# EAGLE schematic carcomputer_split3 (EAGLE 9.3.2)
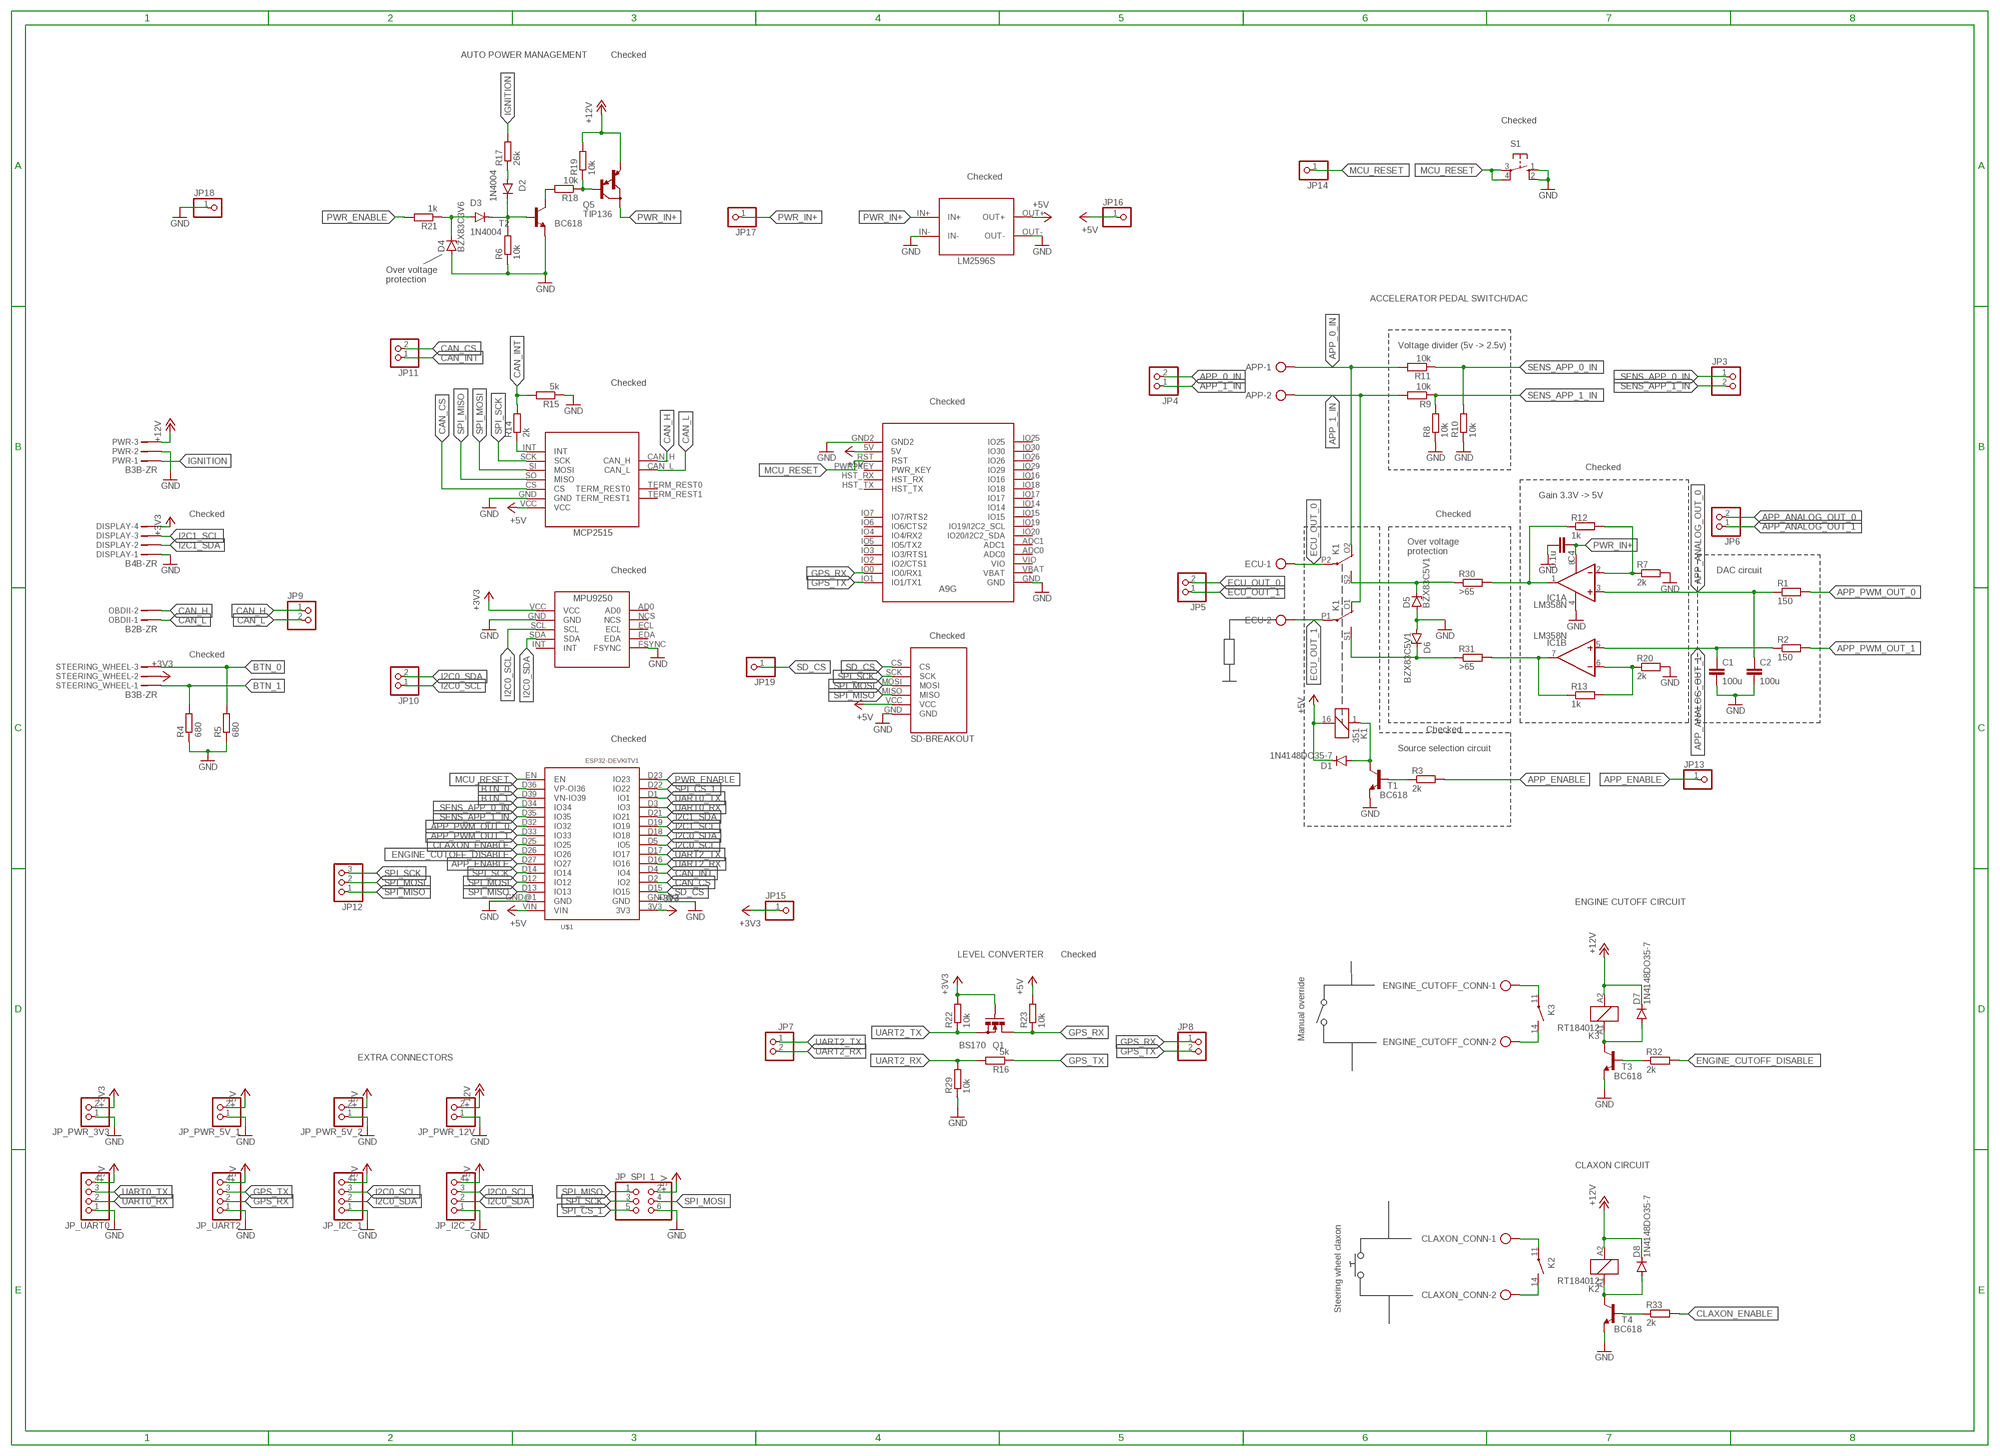
[diagram p0: schematic, sheet 1]

## Parts
APP  AK300/2  [AK300/2]
C1  100u  C-EU025-050X050  [C025-050X050]
C2  100u  C-EU025-050X050  [C025-050X050]
C4  0.1u  C-EU025-050X050  [C025-050X050]
CLAXON_CONN  AK300/2  [AK300/2]
D1  1N4148DO35-7  [DO35-7]
D2  1N4004  [DO41-10]
D3  1N4004  [DO41-10]
D4  BZX83C3V6  BZX85  [DO41Z10]
D5  BZX83C5V1  BZX85  [DO41Z10]
D6  BZX83C5V1  BZX85  [DO41Z10]
D7  1N4148DO35-7  [DO35-7]
D8  1N4148DO35-7  [DO35-7]
DISPLAY  B4B-ZR  [B4B-ZR]
ECU  AK300/2  [AK300/2]
ENGINE_CUTOFF_CONN  AK300/2  [AK300/2]
IC1  LM358N  [DIL08]
JP3  PINHD-1X2  [1X02]
JP4  PINHD-1X2  [1X02]
JP5  PINHD-1X2  [1X02]
JP6  PINHD-1X2  [1X02]
JP7  PINHD-1X2  [1X02]
JP8  PINHD-1X2  [1X02]
JP9  PINHD-1X2  [1X02]
JP10  PINHD-1X2  [1X02]
JP11  PINHD-1X2  [1X02]
JP12  PINHD-1X3  [1X03]
JP13  PINHD-1X1  [1X01]
JP14  PINHD-1X1  [1X01]
JP15  PINHD-1X1  [1X01]
JP16  PINHD-1X1  [1X01]
JP17  PINHD-1X1  [1X01]
JP18  PINHD-1X1  [1X01]
JP19  PINHD-1X1  [1X01]
JP_I2C_1  PINHD-1X4  [1X04]
JP_I2C_2  PINHD-1X4  [1X04]
JP_PWR_3V3  PINHD-1X2  [1X02]
JP_PWR_5V_1  PINHD-1X2  [1X02]
JP_PWR_5V_2  PINHD-1X2  [1X02]
JP_PWR_12V  PINHD-1X2  [1X02]
JP_SPI_1  PINHD-2X3  [2X03]
JP_UART0  PINHD-1X4  [1X04]
JP_UART2  PINHD-1X4  [1X04]
K1  351  [351]
K2  RT184012  [RT-N/O12A3.5]
K3  RT184012  [RT-N/O12A3.5]
OBDII  B2B-ZR  [B2B-ZR]
PWR  B3B-ZR  [B3B-ZR]
Q1  BS170  [SOT54E]
Q5  TIP136  [TO220]
R1  150  R-EU_0207/7  [0207/7]
R2  150  R-EU_0207/7  [0207/7]
R3  2k  R-EU_0207/7  [0207/7]
R4  680  R-EU_0207/7  [0207/7]
R5  680  R-EU_0207/7  [0207/7]
R6  10k  R-EU_0207/7  [0207/7]
R7  2k  R-EU_0207/7  [0207/7]
R8  10k  R-EU_0207/7  [0207/7]
R9  10k  R-EU_0207/7  [0207/7]
R10  10k  R-EU_0207/7  [0207/7]
R11  10k  R-EU_0207/7  [0207/7]
R12  1k  R-EU_0207/7  [0207/7]
R13  1k  R-EU_0207/7  [0207/7]
R14  2k  R-EU_0207/7  [0207/7]
R15  5k  R-EU_0207/7  [0207/7]
R16  5k  R-EU_0207/7  [0207/7]
R17  26k  R-EU_0207/7  [0207/7]
R18  10k  R-EU_0207/7  [0207/7]
R19  10k  R-EU_0207/7  [0207/7]
R20  2k  R-EU_0207/7  [0207/7]
R21  1k  R-EU_0207/7  [0207/7]
R22  10k  R-EU_0207/7  [0207/7]
R23  10k  R-EU_0207/7  [0207/7]
R29  10k  R-EU_0207/7  [0207/7]
R30  >65  R-EU_0207/7  [0207/7]
R31  >65  R-EU_0207/7  [0207/7]
R32  2k  R-EU_0207/7  [0207/7]
R33  2k  R-EU_0207/7  [0207/7]
S1  10-XX  [B3F-10XX]
STEERING_WHEEL  B3B-ZR  [B3B-ZR]
T1  BC618  [TO92-EBC]
T2  BC618  [TO92-EBC]
T3  BC618  [TO92-EBC]
T4  BC618  [TO92-EBC]
U$1  ESP32DEVKITV1  [ESP32-DEVKITV1]
U$2  MCP2515_DEVBOARDINVERTED  [MCP2515_DEVBOARD_INVERTED]
U$3  MPU9250_BREAKOUT  [MPU9250_BREAKOUT]
U$4  LM2596S  [LM2596S]
U$5  HKD-MICRO-SD-BREAKOUT  [HKD-MICRO-SD-BREAKOUT]
U$6  A9G  [A9G]

## Nets
+3V3: DISPLAY.4 JP15.1 JP_PWR_3V3.2 Q1.G R22.2 STEERING_WHEEL.2 U$1.3V3 U$3.VCC
+5V: D1.C JP16.1 JP_I2C_1.4 JP_I2C_2.4 JP_PWR_5V_1.2 JP_PWR_5V_2.2 JP_SPI_1.2 JP_UART0.4 JP_UART2.4 K1.16 R23.2 U$1.VIN U$2.VCC U$4.OUT+ U$5.VCC U$6.5V
+12V: D7.C D8.C JP_PWR_12V.2 K2.A2 K3.A2 PWR.3 Q5.3(E) R19.2
APP_0_IN: APP.1 JP4.2 K1.O2(3:O) R11.2
APP_1_IN: APP.2 JP4.1 K1.O1(2:O) R9.2
APP_ANALOG_OUT_0: C2.1 IC1.3(A:+IN) JP6.2 R1.1
APP_ANALOG_OUT_1: C1.1 IC1.5(B:+IN) JP6.1 R2.1
APP_ENABLE: JP13.1 R3.2 U$1.D27(IO27)
APP_PWM_OUT_0: R1.2 U$1.D32(IO32)
APP_PWM_OUT_1: R2.2 U$1.D33(IO33)
BTN_0: R5.2 STEERING_WHEEL.3 U$1.D36(VP-OI36)
BTN_1: R4.2 STEERING_WHEEL.1 U$1.D39(VN-IO39)
CAN_CS: JP11.2 U$1.D2(IO2) U$2.CS
CAN_H: JP9.1 OBDII.2 U$2.CAN_H
CAN_INT: JP11.1 R14.2 R15.2 U$1.D4(IO4)
CAN_L: JP9.2 OBDII.1 U$2.CAN_L
CLAXON_ENABLE: R33.2 U$1.D25(IO25)
ECU_OUT_0: ECU.1 JP5.2 K1.P2(3:P)
ECU_OUT_1: ECU.2 JP5.1 K1.P1(2:P)
ENGINE_CUTOFF_DISABLE: R32.2 U$1.D26(IO26)
GND: C1.2 C2.2 C4.2 D4.A D5.A D6.A DISPLAY.1 IC1.4(P:V-) JP18.1 JP_I2C_1.1 JP_I2C_2.1 JP_PWR_3V3.1 JP_PWR_5V_1.1 JP_PWR_5V_2.1 JP_PWR_12V.1 JP_SPI_1.6 JP_UART0.1 JP_UART2.1 PWR.2 R4.1 R5.1 R6.1 R7.2 R8.1 R10.1 R15.1 R20.2 R29.1 S1.1(S) S1.2(S1) T1.E T2.E T3.E T4.E U$1.GND@1(GND) U$1.GND@2(GND) U$2.GND U$3.FSYNC U$3.GND U$4.IN- U$4.OUT- U$5.GND U$6.GND U$6.GND2
GPS_RX: JP8.1 JP_UART2.2 Q1.D R23.1 U$6.IO0(IO0/RX1)
GPS_TX: JP8.2 JP_UART2.3 R16.1 U$6.IO1(IO1/TX1)
I2C0_SCL: JP10.1 JP_I2C_1.3 JP_I2C_2.3 U$1.D5(IO5) U$3.SCL
I2C0_SDA: JP10.2 JP_I2C_1.2 JP_I2C_2.2 U$1.D18(IO18) U$3.SDA
I2C1_SCL: DISPLAY.3 U$1.D19(IO19)
I2C1_SDA: DISPLAY.2 U$1.D21(IO21)
IGNITION: PWR.1 R17.2
MCU_RESET: JP14.1 S1.3(P) S1.4(P1) U$1.EN U$6.RST
N$1: D1.A K1.1 T1.C
N$2: R3.1 T1.B
N$3: D6.C K1.S1(2:S) R31.1
N$4: IC1.1(A:OUT) R12.1 R30.2
N$5: D2.C D3.C R6.2 T2.B
N$10: R14.1 U$2.INT
N$11: D3.A D4.C R21.1
N$12: D2.A R17.1
N$13: IC1.2(A:-IN) R7.1 R12.2
N$14: Q5.1(B) R18.1 R19.1
N$15: R18.2 T2.C
N$16: IC1.6(B:-IN) R13.2 R20.1
N$17: D5.C K1.S2(3:S) R30.1
N$18: IC1.7(B:OUT) R13.1 R31.2
N$19: ENGINE_CUTOFF_CONN.1 K3.11(2:P)
N$20: ENGINE_CUTOFF_CONN.2 K3.14(2:S)
N$22: D7.A K3.A1 T3.C
N$23: D8.A K2.A1 T4.C
N$25: R33.1 T4.B
N$26: R32.1 T3.B
N$27: CLAXON_CONN.1 K2.11(2:P)
N$28: CLAXON_CONN.2 K2.14(2:S)
PWR_ENABLE: R21.2 U$1.D23(IO23)
PWR_IN+: C4.1 IC1.8(P:V+) JP17.1 Q5.2(C) U$4.IN+
SD_CS: JP19.1 U$1.D15(IO15) U$5.CS
SENS_APP_0_IN: JP3.1 R10.2 R11.1 U$1.D34(IO34)
SENS_APP_1_IN: JP3.2 R8.2 R9.1 U$1.D35(IO35)
SPI_CS_1: JP_SPI_1.5 U$1.D22(IO22)
SPI_MISO: JP12.1 JP_SPI_1.1 U$1.D13(IO13) U$2.SO(MISO) U$5.MISO
SPI_MOSI: JP12.2 JP_SPI_1.4 U$1.D12(IO12) U$2.SI(MOSI) U$5.MOSI
SPI_SCK: JP12.3 JP_SPI_1.3 U$1.D14(IO14) U$2.SCK U$5.SCK
UART0_RX: JP_UART0.2 U$1.D3(IO3)
UART0_TX: JP_UART0.3 U$1.D1(IO1)
UART2_RX: JP7.2 R16.2 R29.2 U$1.D16(IO16)
UART2_TX: JP7.1 Q1.S R22.1 U$1.D17(IO17)
Unconnected: U$2.TERM_REST0 U$2.TERM_REST1 U$3.AD0 U$3.ECL U$3.EDA U$3.INT U$3.NCS U$6.ADC0 U$6.ADC1 U$6.HST_RX U$6.HST_TX U$6.IO2(IO2/CTS1) U$6.IO3(IO3/RTS1) U$6.IO4(IO4/RX2) U$6.IO5(IO5/TX2) U$6.IO6(IO6/CTS2) U$6.IO7(IO7/RTS2) U$6.IO14 U$6.IO15 U$6.IO16 U$6.IO17 U$6.IO18 U$6.IO19(IO19/I2C2_SCL) U$6.IO20(IO20/I2C2_SDA) U$6.IO25 U$6.IO26 U$6.IO29 U$6.IO30 U$6.PWR_KEY U$6.VBAT U$6.VIO

## Notes on the sheet
- AUTO POWER MANAGEMENT | Checked
- Checked
- Checked
- Over voltage
  protection
- ACCELERATOR PEDAL SWITCH/DAC
- Voltage divider (5v -> 2.5v)
- Checked
- Checked
- Checked
- Gain 3.3V -> 5V
- Checked | Checked
- Over voltage
  protection
- Checked | DAC circuit
- Checked
- Checked
- Checked
- Checked
- Source selection circuit
- ENGINE CUTOFF CIRCUIT
- LEVEL CONVERTER | Checked
- Manual override
- EXTRA CONNECTORS
- CLAXON CIRCUIT
- Steering wheel claxon

## Library data of the parts
APP CLAXON_CONN ECU ENGINE_CUTOFF_CONN = con-ptr500-custom:AK300/2: CONNECTOR; OC_FARNELL: unknown; OC_NEWARK: unknown
C1 C2 C4 = rcl:C-EU: CAPACITOR, European symbol; SPICEPREFIX: C
D1 D7 D8 = diode:1N4148: DIODE high speed (Philips)
D2 D3 = diode:1N4004: DIODE general purpose rectifier, 1 A
D4-D6 = diode:BZX85: Z DIODE
DISPLAY = con-jst-custom:?4B-ZR: ZH CONNECTOR 1.5 mm, 4 pin 1 row Source: http://www.jst.com .. eZH.pdf; MF: FARNELL; MPN: B4B-ZR(LF)(SN); OC_FARNELL: 1830916; OC_NEWARK: 37K9960
IC1 = linear:LM358: OP AMP also LM158; LM258; LM2904 Source: http://cache.national.com/ds/LM/LM158.pdf
JP3-JP11 JP_PWR_3V3 JP_PWR_5V_1 JP_PWR_5V_2 JP_PWR_12V = pinhead:PINHD-1X2: PIN HEADER
JP12 = pinhead:PINHD-1X3: PIN HEADER
JP13-JP19 = pinhead:PINHD-1X1: PIN HEADER
JP_I2C_1 JP_I2C_2 JP_UART0 JP_UART2 = pinhead:PINHD-1X4: PIN HEADER
JP_SPI_1 = pinhead:PINHD-2X3: PIN HEADER
K1 = relay:351: RELAY 2 x switch, Omron; OC_FARNELL: unknown; OC_NEWARK: unknown
K2 K3 = relay:RT?*: Power PCB Relay SCHRACK 1 pole 12 / 16 A, DC- or AC-coil Source: http://www.schrack.com/.. 5819.pdf; MF: TYCO ELECTRONICS; MPN: RT184012; OC_FARNELL: unknown; OC_NEWARK: 08H3731
OBDII = con-jst-custom:?2B-ZR: ZH CONNECTOR 1.5 mm, 4 pin 1 row Source: http://www.jst.com .. eZH.pdf
PWR STEERING_WHEEL = con-jst-custom:?3B-ZR: ZH CONNECTOR 1.5 mm, 4 pin 1 row Source: http://www.jst.com .. eZH.pdf
Q1 = transistor-small-signal:BS170: N-CHANNEL MOS FET
Q5 = transistor-pnp:TIP136: PNP Darlington Transistor
R1-R23 R29-R33 = rcl:R-EU_: RESISTOR, European symbol; SPICEPREFIX: R
S1 = switch-omron:10-XX: OMRON SWITCH; MPN: B3F-1000; OC_FARNELL: 176432; OC_NEWARK: 36M3542
T1-T4 = transistor-npn:BC618*: NPN Transistor
U$1 = ESP32-DEVKITV1:ESP32DEVKITV1
U$2 = MCP2515:MCP2515_DEVBOARD
U$3 = MPU9250:MPU9250_BREAKOUT
U$4 = PSU:LM2596S
U$5 = sd-mmc:HKD-MICRO-SD-BREAKOUT
U$6 = A9:A9G